# Altium schematic sheet Top Level.SchDoc: xcore.ai Multi Channel Audio
size 584 x 408 mm; DocumentNumber: 1; Revision: 1V1; SheetNumber: 1; SheetTotal: 8
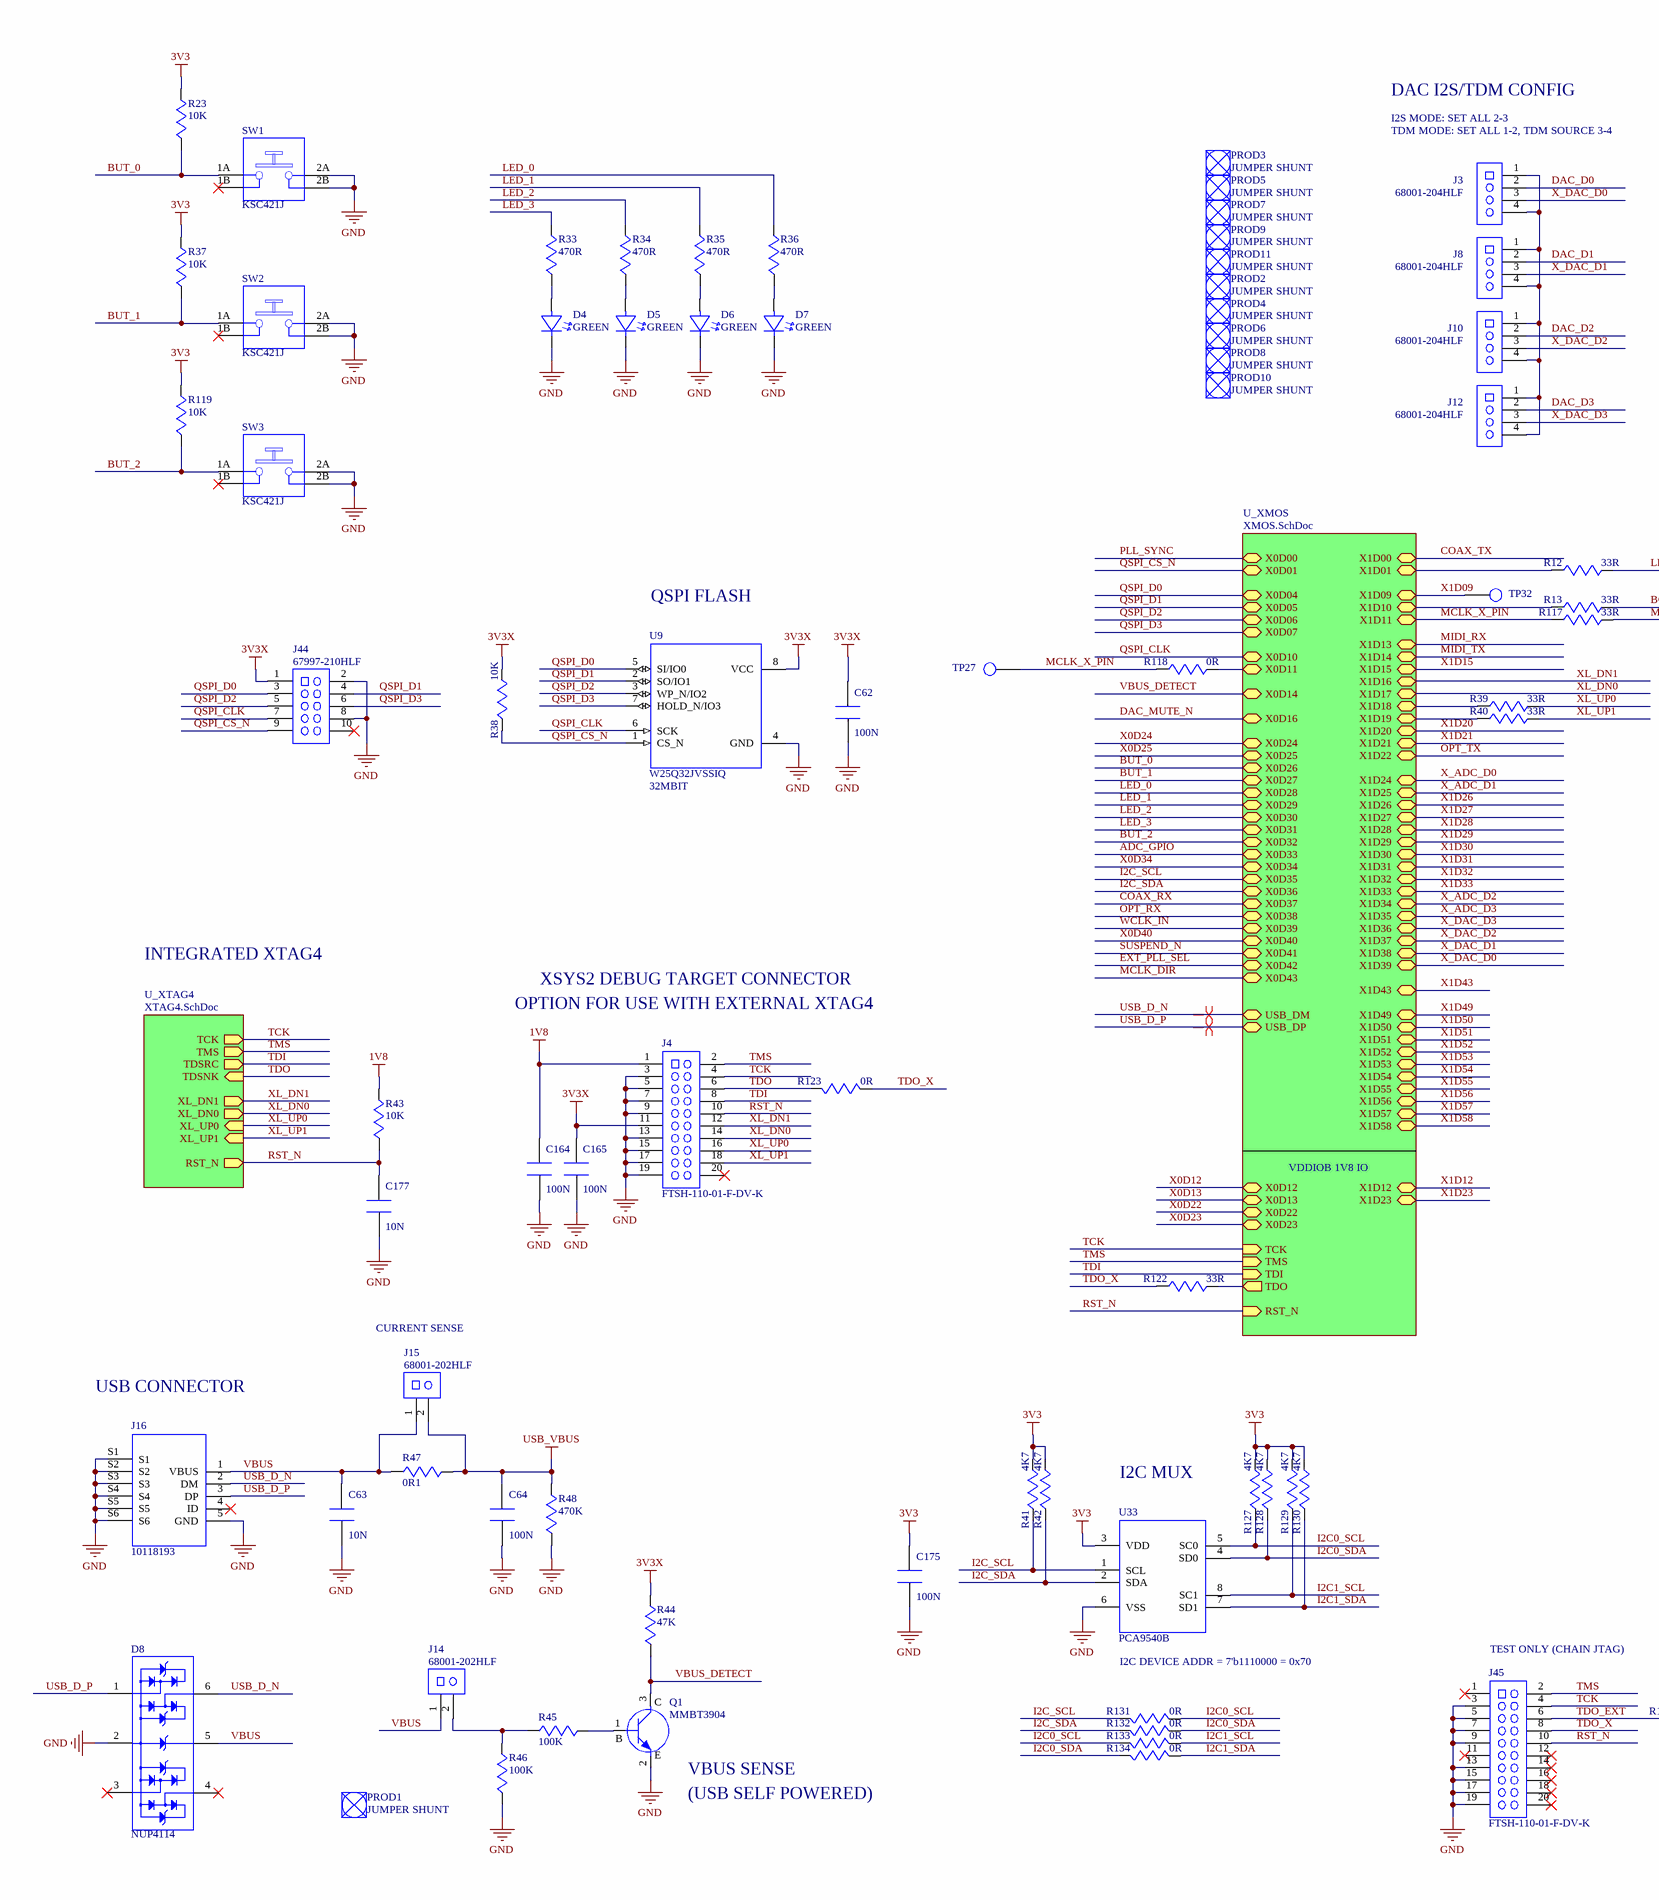
[diagram p0: Top Level.SchDoc, left]
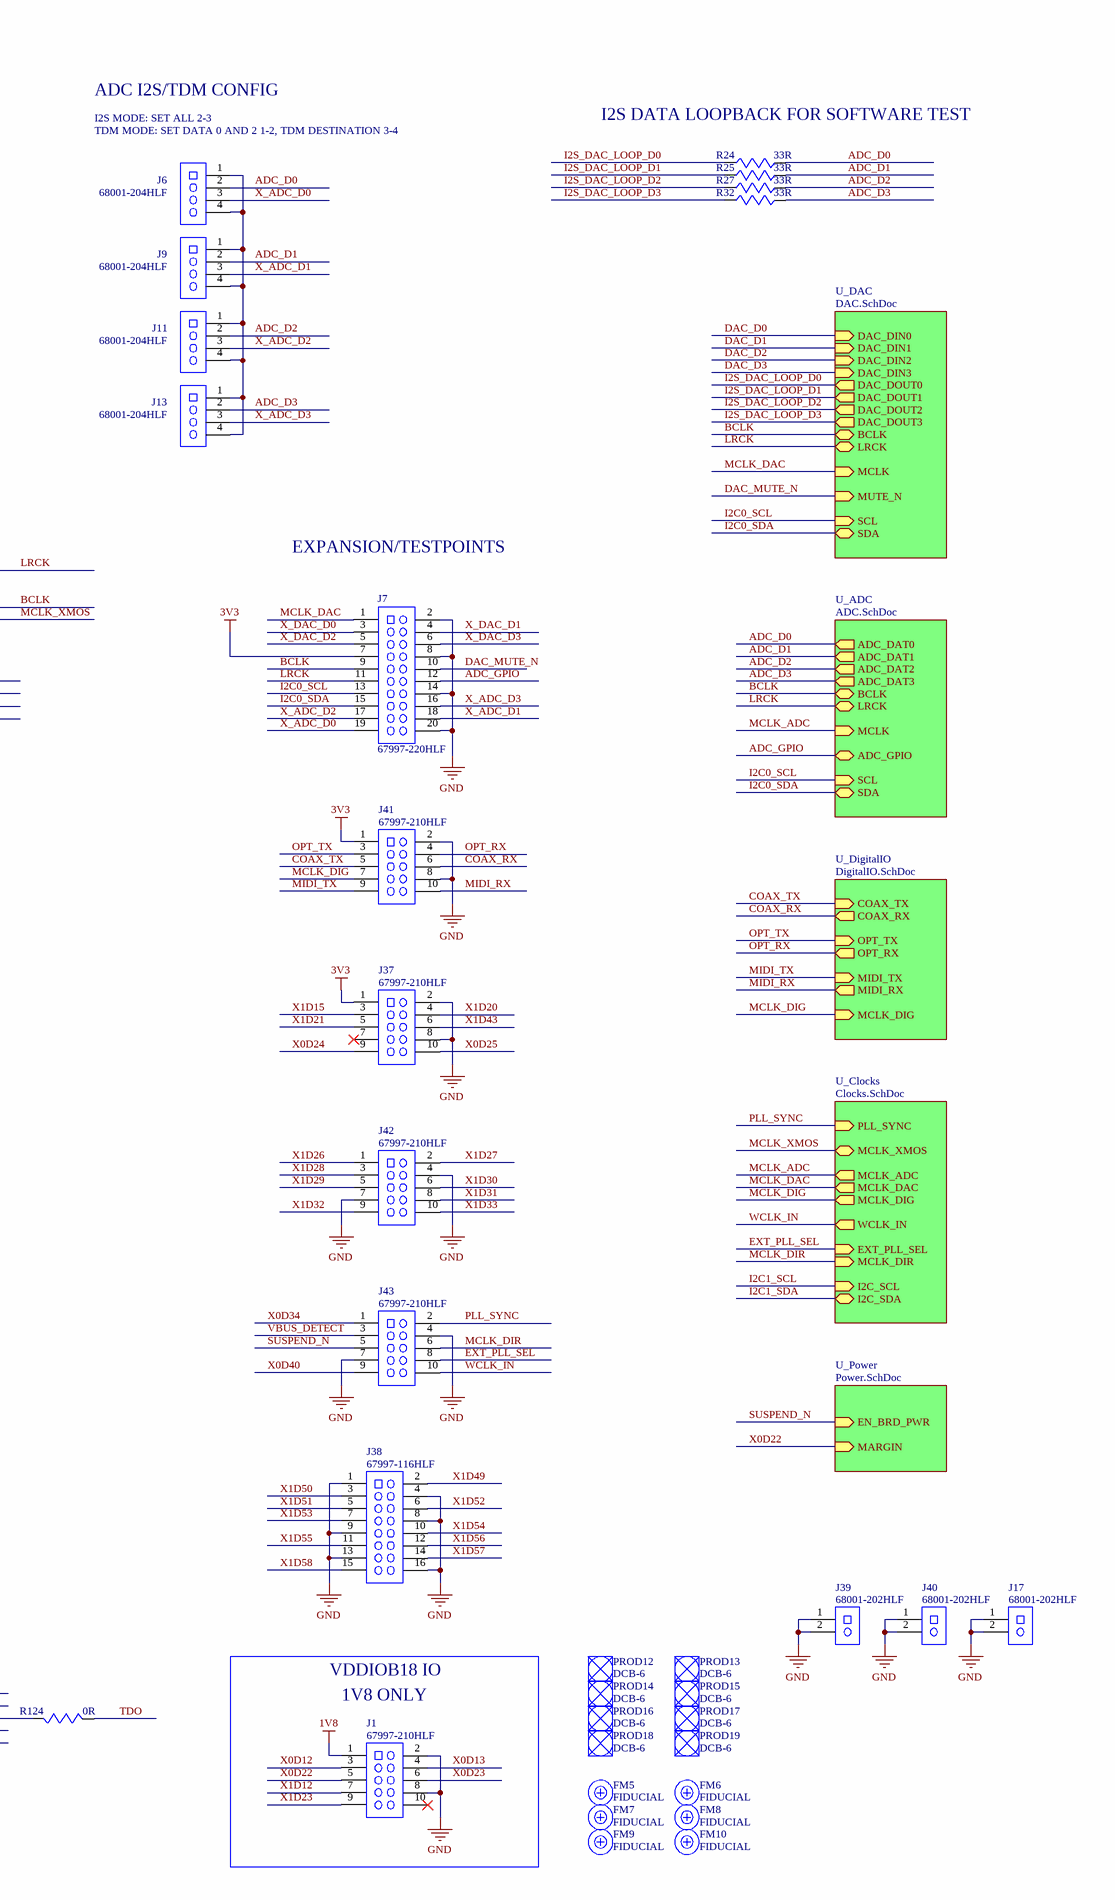
[diagram p1: Top Level.SchDoc, right]

## Parts
C62  100N  [CAPC1005X55N]
C63  10N  [CAPC1005X55N]
C64  100N  [CAPC1005X55N]
C164  100N  [CAPC1005X55N]
C165  100N  [CAPC1005X55N]
C175  100N  [CAPC1005X55N]
C177  10N  [CAPC1005X55N]
D4  Colour: GREEN  [LEDC1608X85N]  (hidden comment: APT1608)
D5  Colour: GREEN  [LEDC1608X85N]  (hidden comment: APT1608)
D6  Colour: GREEN  [LEDC1608X85N]  (hidden comment: APT1608)
D7  Colour: GREEN  [LEDC1608X85N]  (hidden comment: APT1608)
D8  NUP4114  [SOT65P210X110-6N]
FM5  FIDUCIAL  [FIDUCIAL_10_20]  (no BOM)
FM6  FIDUCIAL  [FIDUCIAL_10_20]  (no BOM)
FM7  FIDUCIAL  [FIDUCIAL_10_20]  (no BOM)
FM8  FIDUCIAL  [FIDUCIAL_10_20]  (no BOM)
FM9  FIDUCIAL  [FIDUCIAL_10_20]  (no BOM)
FM10  FIDUCIAL  [FIDUCIAL_10_20]  (no BOM)
J1  67997-210HLF  [HDR_FCI_67997_X10]
J3  68001-204HLF  [HDR_FCI_68001_204]
J4  FTSH-110-01-F-DV-K  [CON_SAMTEC_FTSH_110_01_X_DV_K]
J6  68001-204HLF  [HDR_FCI_68001_204]
J7  67997-220HLF  [HDR_FCI_67997_220]
J8  68001-204HLF  [HDR_FCI_68001_204]
J9  68001-204HLF  [HDR_FCI_68001_204]
J10  68001-204HLF  [HDR_FCI_68001_204]
J11  68001-204HLF  [HDR_FCI_68001_204]
J12  68001-204HLF  [HDR_FCI_68001_204]
J13  68001-204HLF  [HDR_FCI_68001_204]
J14  68001-202HLF  [HDR_FCI_68001_202]
J15  68001-202HLF  [HDR_FCI_68001_202]
J16  10118193  [CON_FCI_10118193]
J17  68001-202HLF  [HDR_FCI_68001_202]
J37  67997-210HLF  [HDR_FCI_67997_X10]
J38  67997-116HLF  [HDR_FCI_67997_116]
J39  68001-202HLF  [HDR_FCI_68001_202]
J40  68001-202HLF  [HDR_FCI_68001_202]
J41  67997-210HLF  [HDR_FCI_67997_X10]
J42  67997-210HLF  [HDR_FCI_67997_X10]
J43  67997-210HLF  [HDR_FCI_67997_X10]
J44  67997-210HLF  [HDR_FCI_67997_X10]
J45  FTSH-110-01-F-DV-K  [CON_SAMTEC_FTSH_110_01_X_DV_K]
PROD1  JUMPER SHUNT  (mechanical)
PROD2  JUMPER SHUNT  (mechanical)
PROD3  JUMPER SHUNT  (mechanical)
PROD4  JUMPER SHUNT  (mechanical)
PROD5  JUMPER SHUNT  (mechanical)
PROD6  JUMPER SHUNT  (mechanical)
PROD7  JUMPER SHUNT  (mechanical)
PROD8  JUMPER SHUNT  (mechanical)
PROD9  JUMPER SHUNT  (mechanical)
PROD10  JUMPER SHUNT  (mechanical)
PROD11  JUMPER SHUNT  (mechanical)
PROD12  DCB-6  (mechanical)
PROD13  DCB-6  (mechanical)
PROD14  DCB-6  (mechanical)
PROD15  DCB-6  (mechanical)
PROD16  DCB-6  (mechanical)
PROD17  DCB-6  (mechanical)
PROD18  DCB-6  (mechanical)
PROD19  DCB-6  (mechanical)
Q1  MMBT3904  [SOT95P235X115-3N]
R12  33R  [RESC1608X55N]
R13  33R  [RESC1608X55N]
R23  10K  [RESC1608X55N]
R24  33R  [RESC1608X55N]
R25  33R  [RESC1608X55N]
R27  33R  [RESC1608X55N]
R32  33R  [RESC1608X55N]
R33  470R  [RESC1608X55N]
R34  470R  [RESC1608X55N]
R35  470R  [RESC1608X55N]
R36  470R  [RESC1608X55N]
R37  10K  [RESC1608X55N]
R38  10K  [RESC1608X55N]
R39  33R  [RESC1608X55N]
R40  33R  [RESC1608X55N]
R41  4K7  [RESC1608X55N]
R42  4K7  [RESC1608X55N]
R43  10K  [RESC1608X55N]
R44  47K  [RESC1608X55N]
R45  100K  [RESC1608X55N]
R46  100K  [RESC1608X55N]
R47  0R1  [RESC2012X60N]
R48  470K  [RESC1608X55N]
R117  33R  [RESC1608X55N]
R118  0R  [RESC1608X55N]
R119  10K  [RESC1608X55N]
R122  33R  [RESC1608X55N]
R123  0R  [RESC1608X55N]
R124  0R  [RESC1608X55N]
R127  4K7  [RESC1608X55N]
R128  4K7  [RESC1608X55N]
R129  4K7  [RESC1608X55N]
R130  4K7  [RESC1608X55N]
R131  0R  [RESC1608X55N]
R132  0R  [RESC1608X55N]
R133  0R  [RESC1608X55N]
R134  0R  [RESC1608X55N]
SW1  KSC421J  [SW_CK_KSC4_JBEND]
SW2  KSC421J  [SW_CK_KSC4_JBEND]
SW3  KSC421J  [SW_CK_KSC4_JBEND]
TP27  TESTPOINT  [TESTPOINT_SMD_1MM]  (value not drawn)  (no BOM)
TP32  TESTPOINT  [TESTPOINT_SMD_0.9MM_L]  (value not drawn)  (no BOM)
U9  W25Q32JVSSIQ  Memory Size: 32MBIT  [SOIC127P790X220-8N]
U33  PCA9540B  [SOP65P490X110-8N]

## Sub-sheets
U_ADC = ADC.SchDoc: MCLK (in), BCLK (bidir), LRCK (bidir), SCL (in), SDA (bidir), ADC_DAT0 (out), ADC_DAT2 (out), ADC_DAT1 (out), ADC_DAT3 (out), ADC_GPIO (bidir)
U_Clocks = Clocks.SchDoc: PLL_SYNC (in), I2C_SDA (bidir), I2C_SCL (in), MCLK_XMOS (bidir), MCLK_ADC (out), MCLK_DAC (out), WCLK_IN (out), MCLK_DIG (out), EXT_PLL_SEL (in), MCLK_DIR (in)
U_DAC = DAC.SchDoc: MCLK (in), BCLK (bidir), LRCK (bidir), SCL (in), SDA (bidir), DAC_DOUT0 (out), DAC_DIN3 (in), DAC_DIN1 (in), DAC_DIN2 (in), DAC_DIN0 (in), MUTE_N (in), DAC_DOUT1 (out), DAC_DOUT3 (out), DAC_DOUT2 (out)
U_DigitalIO = DigitalIO.SchDoc: MIDI_RX (out), MIDI_TX (in), COAX_TX (in), COAX_RX (out), OPT_RX (out), OPT_TX (in), MCLK_DIG (in)
U_Power = Power.SchDoc: EN_BRD_PWR (in), MARGIN (in)
U_XMOS = XMOS.SchDoc: RST_N (in), TDO (out), TDI (in), TMS (in), TCK (in), X0D10 (bidir), X0D07 (bidir), X0D06 (bidir), X0D05 (bidir), X0D04 (bidir), X0D01 (bidir), USB_DM (bidir), USB_DP (bidir), X1D58 (bidir), X1D57 (bidir), X1D56 (bidir), X1D55 (bidir), X1D54 (bidir), X1D53 (bidir), X1D52 (bidir), X1D51 (bidir), X1D50 (bidir), X1D49 (bidir), X1D22 (bidir), X1D21 (bidir), X1D20 (bidir), X1D19 (bidir), X1D18 (bidir), X1D17 (bidir), X1D16 (bidir), X1D15 (bidir), X1D14 (bidir), X1D13 (bidir), X0D38 (bidir), X0D37 (bidir), X0D36 (bidir), X0D35 (bidir), X0D29 (bidir), X0D28 (bidir), X0D27 (bidir), X0D26 (bidir), X0D25 (bidir), X0D24 (bidir), X1D43 (bidir), X1D35 (bidir), X1D34 (bidir), X1D33 (bidir), X1D32 (bidir), X1D31 (bidir), X1D30 (bidir), X1D29 (bidir), X1D36 (bidir), X1D39 (bidir), X1D11 (bidir), X1D10 (bidir), X0D33 (bidir), X0D32 (bidir), X0D40 (bidir), X0D41 (bidir), X0D42 (bidir), X0D43 (bidir), X1D24 (bidir), X1D25 (bidir), X1D26 (bidir), X1D27 (bidir), X1D28 (bidir), X0D39 (bidir), X1D01 (bidir), X1D09 (bidir), X0D30 (bidir), X0D31 (bidir), X1D37 (bidir), X1D38 (bidir), X0D34 (bidir), X1D00 (bidir), X0D11 (bidir), X0D14 (bidir), X0D16 (bidir), X0D00 (bidir), X0D22 (bidir), X1D12 (bidir), X1D23 (bidir), X0D23 (bidir), X0D13 (bidir), X0D12 (bidir)
U_XTAG4 = XTAG4.SchDoc: RST_N (out), XL_UP0 (in), XL_UP1 (in), XL_DN0 (out), XL_DN1 (out), TMS (out), TCK (out), TDSRC (out), TDSNK (in)

## Nets
1V8: C164.1 J1.1 J4.1 R43.2
3V3: C175.1 J7.7 J37.1 J41.1 R23.2 R37.2 R41.2 R42.2 R119.2 R127.2 R128.2 R129.2 R130.2 U33.3(VDD)
3V3X: C62.1 C165.1 J4.11 J44.1 R38.2 R44.2 U9.8(VCC)
GND: C62.2 C63.2 C64.2 C164.2 C165.2 C175.2 C177.2 D4.1(K) D5.1(K) D6.1(K) D7.1(K) D8.2 J1.2 J1.8 J4.3 J4.5 J4.7 J4.9 J4.13 J4.15 J4.17 J4.19 J7.2 J7.8 J7.14 J7.20 J16.5(GND) J16.S1 J16.S2 J16.S3 J16.S4 J16.S5 J16.S6 J17.1 J17.2 J37.2 J37.8 J38.1 J38.4 J38.8 J38.9 J38.13 J38.16 J39.1 J39.2 J40.1 J40.2 J41.2 J41.8 J42.4 J42.7 J43.4 J43.7 J44.2 J44.8 J45.3 J45.5 J45.7 J45.9 J45.13 J45.15 J45.17 J45.19 Q1.2(E1) R46.1 R48.1 SW1.2A SW1.2B SW2.2A SW2.2B SW3.2A SW3.2B U9.4(GND) U33.6(VSS)
USB_VBUS: C64.1 J15.2 R47.2 R48.2
ADC_D0: J6.2 R24.2 ; sheet U_ADC/ADC_DAT0
ADC_D1: J9.2 R25.2 ; sheet U_ADC/ADC_DAT1
ADC_D2: J11.2 R27.2 ; sheet U_ADC/ADC_DAT2
ADC_D3: J13.2 R32.2 ; sheet U_ADC/ADC_DAT3
ADC_GPIO: J7.12 ; sheet U_XMOS/X0D33, sheet U_ADC/ADC_GPIO
BCLK: J7.9 R13.2 ; sheet U_ADC/BCLK, sheet U_DAC/BCLK
BUT_0: R23.1 SW1.1A ; sheet U_XMOS/X0D26
BUT_1: R37.1 SW2.1A ; sheet U_XMOS/X0D27
BUT_2: R119.1 SW3.1A ; sheet U_XMOS/X0D32
COAX_RX: J41.6 ; sheet U_XMOS/X0D37, sheet U_DigitalIO/COAX_RX
COAX_TX: J41.5 ; sheet U_XMOS/X1D00, sheet U_DigitalIO/COAX_TX
DAC_D0: J3.2 ; sheet U_DAC/DAC_DIN0
DAC_D1: J8.2 ; sheet U_DAC/DAC_DIN1
DAC_D2: J10.2 ; sheet U_DAC/DAC_DIN2
DAC_D3: J12.2 ; sheet U_DAC/DAC_DIN3
DAC_MUTE_N: J7.10 ; sheet U_XMOS/X0D16, sheet U_DAC/MUTE_N
EXT_PLL_SEL: J43.8 ; sheet U_XMOS/X0D42, sheet U_Clocks/EXT_PLL_SEL
I2C0_SCL: J7.13 R127.1 R131.1 R133.2 U33.5(SC0) ; sheet U_ADC/SCL, sheet U_DAC/SCL
I2C0_SDA: J7.15 R128.1 R132.1 R134.2 U33.4(SD0) ; sheet U_ADC/SDA, sheet U_DAC/SDA
I2C1_SCL: R129.1 R133.1 U33.8(SC1) ; sheet U_Clocks/I2C_SCL
I2C1_SDA: R130.1 R134.1 U33.7(SD1) ; sheet U_Clocks/I2C_SDA
I2C_SCL: R41.1 R131.2 U33.1(SCL) ; sheet U_XMOS/X0D35
I2C_SDA: R42.1 R132.2 U33.2(SDA) ; sheet U_XMOS/X0D36
I2S_DAC_LOOP_D0: R24.1 ; sheet U_DAC/DAC_DOUT0
I2S_DAC_LOOP_D1: R25.1 ; sheet U_DAC/DAC_DOUT1
I2S_DAC_LOOP_D2: R27.1 ; sheet U_DAC/DAC_DOUT2
I2S_DAC_LOOP_D3: R32.1 ; sheet U_DAC/DAC_DOUT3
LED_0: R36.2 ; sheet U_XMOS/X0D28
LED_1: R35.2 ; sheet U_XMOS/X0D29
LED_2: R34.2 ; sheet U_XMOS/X0D30
LED_3: R33.2 ; sheet U_XMOS/X0D31
LRCK: J7.11 R12.2 ; sheet U_ADC/LRCK, sheet U_DAC/LRCK
MCLK_ADC: sheet U_ADC/MCLK, sheet U_Clocks/MCLK_ADC
MCLK_DAC: J7.1 ; sheet U_DAC/MCLK, sheet U_Clocks/MCLK_DAC
MCLK_DIG: J41.7 ; sheet U_DigitalIO/MCLK_DIG, sheet U_Clocks/MCLK_DIG
MCLK_DIR: J43.6 ; sheet U_XMOS/X0D43, sheet U_Clocks/MCLK_DIR
MCLK_X_PIN: R117.1 R118.1 TP27.1 ; sheet U_XMOS/X1D11
MCLK_XMOS: R117.2 ; sheet U_Clocks/MCLK_XMOS
MIDI_RX: J41.10 ; sheet U_XMOS/X1D13, sheet U_DigitalIO/MIDI_RX
MIDI_TX: J41.9 ; sheet U_XMOS/X1D14, sheet U_DigitalIO/MIDI_TX
OPT_RX: J41.4 ; sheet U_XMOS/X0D38, sheet U_DigitalIO/OPT_RX
OPT_TX: J41.3 ; sheet U_XMOS/X1D22, sheet U_DigitalIO/OPT_TX
PLL_SYNC: J43.2 ; sheet U_XMOS/X0D00, sheet U_Clocks/PLL_SYNC
QSPI_CLK: J44.7 U9.6(SCK) ; sheet U_XMOS/X0D10
QSPI_CS_N: J44.9 R38.1 U9.1(CS_N) ; sheet U_XMOS/X0D01
QSPI_D0: J44.3 U9.5(SI/IO0) ; sheet U_XMOS/X0D04
QSPI_D1: J44.4 U9.2(SO/IO1) ; sheet U_XMOS/X0D05
QSPI_D2: J44.5 U9.3(WP_N/IO2) ; sheet U_XMOS/X0D06
QSPI_D3: J44.6 U9.7(HOLD_N/IO3) ; sheet U_XMOS/X0D07
RST_N: C177.1 J4.10 J45.10 R43.1 ; sheet U_XMOS/RST_N, sheet U_XTAG4/RST_N
SUSPEND_N: J43.5 ; sheet U_XMOS/X0D41, sheet U_Power/EN_BRD_PWR
TCK: J4.4 J45.4 ; sheet U_XMOS/TCK, sheet U_XTAG4/TCK
TDI: J4.8 ; sheet U_XMOS/TDI, sheet U_XTAG4/TDSRC
TDO: J4.6 R123.2 R124.1 ; sheet U_XTAG4/TDSNK
TDO_EXT: J45.6 R124.2
TDO_X: J45.8 R122.1 R123.1
TMS: J4.2 J45.2 ; sheet U_XMOS/TMS, sheet U_XTAG4/TMS
USB_D_N: D8.6 J16.2(DM) ; sheet U_XMOS/USB_DM
USB_D_P: D8.1 J16.3(DP) ; sheet U_XMOS/USB_DP
VBUS: C63.1 D8.5 J14.1 J15.1 J16.1(VBUS) R47.1
VBUS_DETECT: J43.3 Q1.3(C1) R44.1 ; sheet U_XMOS/X0D14
WCLK_IN: J43.10 ; sheet U_XMOS/X0D39, sheet U_Clocks/WCLK_IN
X0D12: J1.3 ; sheet U_XMOS/X0D12
X0D13: J1.4 ; sheet U_XMOS/X0D13
X0D22: J1.5 ; sheet U_XMOS/X0D22, sheet U_Power/MARGIN
X0D23: J1.6 ; sheet U_XMOS/X0D23
X0D24: J37.9 ; sheet U_XMOS/X0D24
X0D25: J37.10 ; sheet U_XMOS/X0D25
X0D34: J43.1 ; sheet U_XMOS/X0D34
X0D40: J43.9 ; sheet U_XMOS/X0D40
X1D09: TP32.1 ; sheet U_XMOS/X1D09
X1D12: J1.7 ; sheet U_XMOS/X1D12
X1D15: J37.3 ; sheet U_XMOS/X1D15
X1D20: J37.4 ; sheet U_XMOS/X1D20
X1D21: J37.5 ; sheet U_XMOS/X1D21
X1D23: J1.9 ; sheet U_XMOS/X1D23
X1D26: J42.1 ; sheet U_XMOS/X1D26
X1D27: J42.2 ; sheet U_XMOS/X1D27
X1D28: J42.3 ; sheet U_XMOS/X1D28
X1D29: J42.5 ; sheet U_XMOS/X1D29
X1D30: J42.6 ; sheet U_XMOS/X1D30
X1D31: J42.8 ; sheet U_XMOS/X1D31
X1D32: J42.9 ; sheet U_XMOS/X1D32
X1D33: J42.10 ; sheet U_XMOS/X1D33
X1D43: J37.6 ; sheet U_XMOS/X1D43
X1D49: J38.2 ; sheet U_XMOS/X1D49
X1D50: J38.3 ; sheet U_XMOS/X1D50
X1D51: J38.5 ; sheet U_XMOS/X1D51
X1D52: J38.6 ; sheet U_XMOS/X1D52
X1D53: J38.7 ; sheet U_XMOS/X1D53
X1D54: J38.10 ; sheet U_XMOS/X1D54
X1D55: J38.11 ; sheet U_XMOS/X1D55
X1D56: J38.12 ; sheet U_XMOS/X1D56
X1D57: J38.14 ; sheet U_XMOS/X1D57
X1D58: J38.15 ; sheet U_XMOS/X1D58
X_ADC_D0: J6.3 J7.19 ; sheet U_XMOS/X1D24
X_ADC_D1: J7.18 J9.3 ; sheet U_XMOS/X1D25
X_ADC_D2: J7.17 J11.3 ; sheet U_XMOS/X1D34
X_ADC_D3: J7.16 J13.3 ; sheet U_XMOS/X1D35
X_DAC_D0: J3.3 J7.3 ; sheet U_XMOS/X1D39
X_DAC_D1: J7.4 J8.3 ; sheet U_XMOS/X1D38
X_DAC_D2: J7.5 J10.3 ; sheet U_XMOS/X1D37
X_DAC_D3: J7.6 J12.3 ; sheet U_XMOS/X1D36
XL_DN0: J4.14 ; sheet U_XMOS/X1D17, sheet U_XTAG4/XL_DN0
XL_DN1: J4.12 ; sheet U_XMOS/X1D16, sheet U_XTAG4/XL_DN1
XL_UP0: J4.16 R39.2 ; sheet U_XTAG4/XL_UP0
XL_UP1: J4.18 R40.2 ; sheet U_XTAG4/XL_UP1
NetD4_2: D4.2(A) R33.1
NetD5_2: D5.2(A) R34.1
NetD6_2: D6.2(A) R35.1
NetD7_2: D7.2(A) R36.1
NetJ3_1: J3.1 J3.4 J8.1 J8.4 J10.1 J10.4 J12.1 J12.4
NetJ6_1: J6.1 J6.4 J9.1 J9.4 J11.1 J11.4 J13.1 J13.4
NetJ14_2: J14.2 R45.1 R46.2
NetQ1_1: Q1.1(B1) R45.2
NetR12_1: R12.1 ; sheet U_XMOS/X1D01
NetR13_1: R13.1 ; sheet U_XMOS/X1D10
NetR39_1: R39.1 ; sheet U_XMOS/X1D18
NetR40_1: R40.1 ; sheet U_XMOS/X1D19
NetR118_2: R118.2 ; sheet U_XMOS/X0D11
NetR122_2: R122.2 ; sheet U_XMOS/TDO

Not connected (* = marked no-connect by the designer): D8 3* 4*; J1 10*; J4 20*; J16 4(ID)*; J37 7*; J44 10*; J45 1* 11* 12* 14* 16* 18* 20*; SW1 1B*; SW2 1B*; SW3 1B*

## Layout directives
differential pair; differential pair class USB: USB_D_N, USB_D_P

## Notes on the sheet
- I2S MODE: SET ALL 2-3
- DAC I2S/TDM CONFIG
- ADC I2S/TDM CONFIG
- I2S DATA LOOPBACK FOR SOFTWARE TEST
- (near J3) TDM MODE: SET ALL 1-2, TDM SOURCE 3-4
- (near J6) TDM MODE: SET DATA 0 AND 2 1-2, TDM DESTINATION 3-4
- EXPANSION/TESTPOINTS
- QSPI FLASH
- INTEGRATED XTAG4
- XSYS2 DEBUG TARGET CONNECTOR
- OPTION FOR USE WITH EXTERNAL XTAG4
- VDDIOB 1V8 IO
- CURRENT SENSE
- USB CONNECTOR
- I2C MUX
- I2C DEVICE ADDR = 7'b1110000 = 0x70
- (near J45) TEST ONLY (CHAIN JTAG)
- VDDIOB18 IO
- 1V8 ONLY
- (near Q1) VBUS SENSE
- (near Q1) (USB SELF POWERED)
- Project Name
- Build
- Sheet Name
- Rev
- Date
- Sheet
- of
- (in symbol GEN-16-0051) C; B; E

## Library data of the parts
C62 C64 C164 C165 C175 = STD-06-0048: CHIP CAPACITOR, CERAMIC, 100NF, 16V, 10%, X7R, 0402; Manufacturer: Yageo; Manufacturer Part Number: CC0402KRX7R7BB104; Approx Volume Cost ($): 0.003; VALUE: 100N; Part Number: STD-06-0048; Dielectric: X7R; Rated Voltage: 16V; Tolerance: 10%
  C62 C64 C175: Web Search Link: http://www.google.com/search?q=CC0402KRX7R7BB104
C63 C177 = STD-06-0042: CHIP CAPACITOR, CERAMIC, 10NF, 50V, 10%, X7R, 0402; Manufacturer: Yageo; Manufacturer Part Number: CC0402KRX7R9BB103; Approx Volume Cost ($): 0.002; VALUE: 10N; Part Number: STD-06-0042; Dielectric: X7R; Rated Voltage: 50V; Tolerance: 10%; Web Search Link: http://www.google.com/search?q=CC0402KRX7R9BB103
D4-D7 = GEN-17-0001: LED, GREEN, 0603; Manufacturer: Kingbright; Manufacturer Part Number: APT1608CGCK; Approx Volume Cost ($): 0.05; VALUE: APT1608; Part Number: GEN-17-0001; Web Search Link: http://www.google.com/search?q=APT1608CGCK
D8 = GEN-16-0048: ESD Protection Diode Array, 0.6pF, SC-70-6 (SC-88); Manufacturer: ON Semiconductor; Manufacturer Part Number: NUP4114UCLW1T2G; Approx Volume Cost ($): 0.1; VALUE: NUP4114; Part Number: GEN-16-0048; Web Search Link: http://www.google.com/search?q=NUP4114UCLW1T2G
FM5-FM10 = GEN-24-0001: Fiducial, Circle, 1mm Pad, 2mm Keepout; Manufacturer: NA; VALUE: FIDUCIAL; Part Number: GEN-24-0001; Manufacturer Part Number: NA; Approx Volume Cost ($): NA
J1 J37 J41-J44 = GEN-01-0029: Pin Header, Male, Vertical, Through Hole, 10 Way, 2x5, 0.1 Inch Pitch; Manufacturer: FCI; Approx Volume Cost ($): 0.2; VALUE: 67997-210HLF; Part Number: GEN-01-0029; Manufacturer Part Number: 67997-210HLF; Web Search Link: http://www.google.com/search?q=67997-210HLF
J3 J6 J8-J13 = GEN-01-0125: Pin Header, Male, Vertical, Through Hole, 4 Way, 1x4, 0.1 Inch Pitch; Manufacturer: FCI; Approx Volume Cost ($): 0.18; VALUE: 68001-204HLF; Part Number: GEN-01-0125; Manufacturer Part Number: 68001-204HLF; Web Search Link: http://www.google.com/search?q=68001-204HLF
J4 J45 = GEN-01-0126: Pin Header, Male, Vertical, 20 Way, 2x10, 1.27mm Pitch, Keying Shroud, SMD; Manufacturer: Samtec; Approx Volume Cost ($): 3.7; VALUE: FTSH-110-01-F-DV-K; Part Number: GEN-01-0126; Manufacturer Part Number: FTSH-110-01-F-DV-K; Web Search Link: http://www.google.com/search?q=FTSH-110-01-F-DV-K
J7 = GEN-01-0070: Pin Header, Male, Vertical, Through Hole, 20 Way, 2x10, 0.1 Inch Pitch; Manufacturer: FCI; Approx Volume Cost ($): 0.73; VALUE: 67997-220HLF; Part Number: GEN-01-0070; Manufacturer Part Number: 67997-220HLF; Web Search Link: http://www.google.com/search?q=67997-220HLF
J14 J15 J17 J39 J40 = GEN-01-0011: Pin Header, Male, Vertical, Through Hole, 2 Way, 1x2, 0.1 Inch Pitch; Manufacturer: FCI; Approx Volume Cost ($): 0.08; VALUE: 68001-202HLF; Part Number: GEN-01-0011; Manufacturer Part Number: 68001-202HLF
  J14 J15 J39 J40: Web Search Link: http://www.google.com/search?q=68001-202HLF
J16 = GEN-01-0020: USB Micro B Receptacle, Right Angle, SMD w/2 DIP Legs; Manufacturer: FCI; Manufacturer Part Number: 10118193-0001LF; Approx Volume Cost ($): 0.19; VALUE: 10118193; Part Number: GEN-01-0020; Web Search Link: http://www.google.com/search?q=10118193-0001LF
J38 = GEN-01-0019: Pin Header, Male, Through Hole, 16 Way, 2x8, 0.76u Gold, 0.1 Inch Pitch; Manufacturer: FCI; Approx Volume Cost ($): 0.29; VALUE: 67997-116HLF; Part Number: GEN-01-0019; Manufacturer Part Number: 67997-116HLF
PROD1-PROD11 = GEN-23-0011: Jumper Shunt, Single Circuit, Open Type, 2.54mm Pitch, 6mm High, Gold Flash; Manufacturer: Sullins; Manufacturer Part Number: QPC02SXGN-RC; Approx Volume Cost ($): 0.03; VALUE: JUMPER SHUNT; Part Number: GEN-23-0011; Web Search Link: http://www.google.com/search?q=QPC02SXGN-RC
PROD12-PROD19 = GEN-23-0002: Snap-in PCB Spacer Support, 6mm; Manufacturer: KANG YANG (Toby Electronics); Approx Volume Cost ($): 0.01; VALUE: DCB-6; Part Number: GEN-23-0002; Manufacturer Part Number: DCB-6; Web Search Link: http://www.google.com/search?q=DCB-6
Q1 = GEN-16-0051: BJT Transistor, NPN, 40V, 200mA, SOT23; Manufacturer: Nexperia; Manufacturer Part Number: MMBT3904,215; Approx Volume Cost ($): 0.02; VALUE: MMBT3904; Part Number: GEN-16-0051; Web Search Link: http://www.google.com/search?q=MMBT3904,215
R12 R13 R24 R25 R27 R32 R39 R40 R117 R122 = STD-02-0026: CHIP RESISTOR, 33 OHM, 0.1W, 1%, 0603; Manufacturer: Yageo; Manufacturer Part Number: RC0603FR-0733RL; Max Voltage: 50V; Max Power: 100mW; Temperature Coefficient: ±100ppm/°C; Approx Volume Cost ($): 0.002; VALUE: 33R; Part Number: STD-02-0026; Tolerance: 1%; Web Search Link: http://www.google.com/search?q=RC0603FR-0733RL
R23 R37 R38 R43 R119 = STD-02-0086: CHIP RESISTOR, 10K OHM, 0.1W, 1%, 0603; Manufacturer: Yageo; Manufacturer Part Number: RC0603FR-0710KL; Max Voltage: 50V; Max Power: 100mW; Temperature Coefficient: ±100ppm/°C; Approx Volume Cost ($): 0.002; VALUE: 10K; Part Number: STD-02-0086; Tolerance: 1%; Web Search Link: http://www.google.com/search?q=RC0603FR-0710KL
R33-R36 = STD-02-0054: CHIP RESISTOR, 470 OHM, 0.1W, 1%, 0603; Manufacturer: Yageo; Manufacturer Part Number: RC0603FR-07470RL; Max Voltage: 50V; Max Power: 100mW; Temperature Coefficient: ±100ppm/°C; Approx Volume Cost ($): 0.002; VALUE: 470R; Part Number: STD-02-0054; Tolerance: 1%; Web Search Link: http://www.google.com/search?q=RC0603FR-07470RL
R41 R42 R127-R130 = STD-02-0078: CHIP RESISTOR, 4.7K OHM, 0.1W, 1%, 0603; Manufacturer: Yageo; Manufacturer Part Number: RC0603FR-074K7L; Max Voltage: 50V; Max Power: 100mW; Temperature Coefficient: ±100ppm/°C; Approx Volume Cost ($): 0.002; VALUE: 4K7; Part Number: STD-02-0078; Tolerance: 1%; Web Search Link: http://www.google.com/search?q=RC0603FR-074K7L
R44 = STD-02-0102: CHIP RESISTOR, 47K OHM, 0.1W, 1%, 0603; Manufacturer: Yageo; Manufacturer Part Number: RC0603FR-0747KL; Max Voltage: 50V; Max Power: 100mW; Temperature Coefficient: ±100ppm/°C; Approx Volume Cost ($): 0.002; VALUE: 47K; Part Number: STD-02-0102; Tolerance: 1%; Web Search Link: http://www.google.com/search?q=RC0603FR-0747KL
R45 R46 = STD-02-0110: CHIP RESISTOR, 100K OHM, 0.1W, 1%, 0603; Manufacturer: Yageo; Manufacturer Part Number: RC0603FR-07100KL; Max Voltage: 50V; Max Power: 100mW; Temperature Coefficient: ±100ppm/°C; Approx Volume Cost ($): 0.002; VALUE: 100K; Part Number: STD-02-0110; Tolerance: 1%; Web Search Link: http://www.google.com/search?q=RC0603FR-07100KL
R47 = GEN-02-0029: CHIP RESISTOR, 0.1 OHM, 250mW, 1%, 0805; Manufacturer: Yageo; Manufacturer Part Number: RL0805FR-7W0R1L; Max Voltage: 50V; Max Power: 0.25W; Temperature Coefficient: ±600ppm/°C; Approx Volume Cost ($): 0.06; VALUE: 0R1; Part Number: GEN-02-0029; Tolerance: 1%; Web Search Link: http://www.google.com/search?q=RL0805FR-7W0R1L
R48 = STD-02-0126: CHIP RESISTOR, 470K OHM, 0.1W, 1%, 0603; Manufacturer: Yageo; Manufacturer Part Number: RC0603FR-07470KL; Max Voltage: 50V; Max Power: 100mW; Temperature Coefficient: ±100ppm/°C; Approx Volume Cost ($): 0.002; VALUE: 470K; Part Number: STD-02-0126; Tolerance: 1%; Web Search Link: http://www.google.com/search?q=RC0603FR-07470KL
R118 R123 R124 R131-R134 = STD-02-0001: CHIP RESISTOR, ZERO OHM JUMPER, 1A, 0603; Manufacturer: Yageo; Manufacturer Part Number: RC0603JR-070RL; Tolerance: NA; Max Voltage: 50V; Approx Volume Cost ($): 0.002; VALUE: 0R; Part Number: STD-02-0001; Max Power: NA; Temperature Coefficient: NA; Web Search Link: http://www.google.com/search?q=RC0603JR-070RL
SW1-SW3 = GEN-20-0004: Tactile Switch, Momentary, J Bend SMD; Manufacturer: C&K; Manufacturer Part Number: KSC421J 70SH LFS; Approx Volume Cost ($): 0.27; VALUE: KSC421J; Part Number: GEN-20-0004; Web Search Link: http://www.google.com/search?q=KSC421J 70SH LFS
TP27 = GEN-24-0003: Testpoint, SMD, 1mm; Manufacturer: NA; VALUE: TESTPOINT; Part Number: GEN-24-0003; Manufacturer Part Number: NA; Approx Volume Cost ($): NA
TP32 = GEN-24-0019: Testpoint, SMD, 0.9mm; Manufacturer: NA; VALUE: TESTPOINT; Part Number: GEN-24-0019; Manufacturer Part Number: NA; Approx Volume Cost ($): NA
U9 = GEN-12-0035: Memory, Flash, SPI, Multi-IO, 32Mb (16Kx256), 2.7 to 3.6V, QE = 1, SOIC-8-W; Manufacturer: Winbond; Approx Volume Cost ($): 0.61; VALUE: W25Q32JVSSIQ; Part Number: GEN-12-0035; Manufacturer Part Number: W25Q32JVSSIQ; Web Search Link: http://www.google.com/search?q=W25Q32JVSSIQ
U33 = GEN-09-0030: 2-channel I2C-bus multiplexer, TSSOP8; Manufacturer: NXP; Manufacturer Part Number: PCA9540BDP,118; Approx Volume Cost ($): 1.64; VALUE: PCA9540B; Part Number: GEN-09-0030; Web Search Link: http://www.google.com/search?q=PCA9540BDP,118